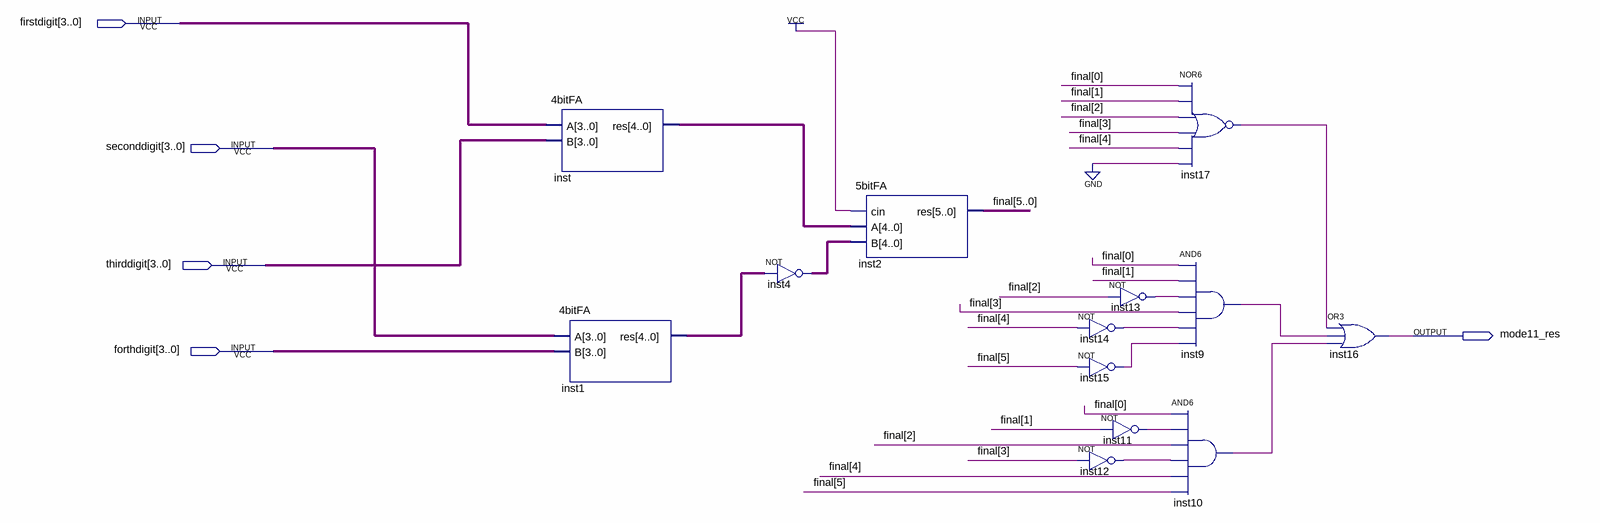
[diagram p0: schematic sheet]
// Quartus schematic mode11_module.bdf as structural Verilog: 13 symbols, 5 pins
module mode11_module (
  input  [3:0] firstdigit,
  input  [3:0] seconddigit,
  input  [3:0] thirddigit,
  input  [3:0] forthdigit,
  output mode11_res
);

  wire inst9_out, inst10_out, inst11_out, inst12_out, inst13_out, inst14_out, inst15_out, inst17_out;
  wire [4:0] inst1_res, inst4_out, inst_res;
  wire [5:0] \final ;

  \4bitFA  inst (.A(firstdigit), .B(thirddigit), .res(inst_res));
  \4bitFA  inst1 (.A(seconddigit), .B(forthdigit), .res(inst1_res));
  assign inst4_out = ~inst1_res;  // NOT inst4, 5 bits wide
  \5bitFA  inst2 (.cin(1'b1), .A(inst_res), .B(inst4_out), .res(\final ));
  not inst14 (inst14_out, \final [4]);
  not inst15 (inst15_out, \final [5]);
  not inst12 (inst12_out, \final [3]);
  not inst13 (inst13_out, \final [2]);
  not inst11 (inst11_out, \final [1]);
  nor inst17 (inst17_out, \final [0], \final [1], \final [2], \final [3], \final [4], 1'b0);
  and inst9 (inst9_out, \final [0], \final [1], inst13_out, \final [3], inst14_out, inst15_out);
  and inst10 (inst10_out, \final [0], inst11_out, \final [2], inst12_out, \final [4], \final [5]);
  or inst16 (mode11_res, inst17_out, inst9_out, inst10_out);
endmodule
